# EAGLE design untitled (EAGLE 9.6.2)
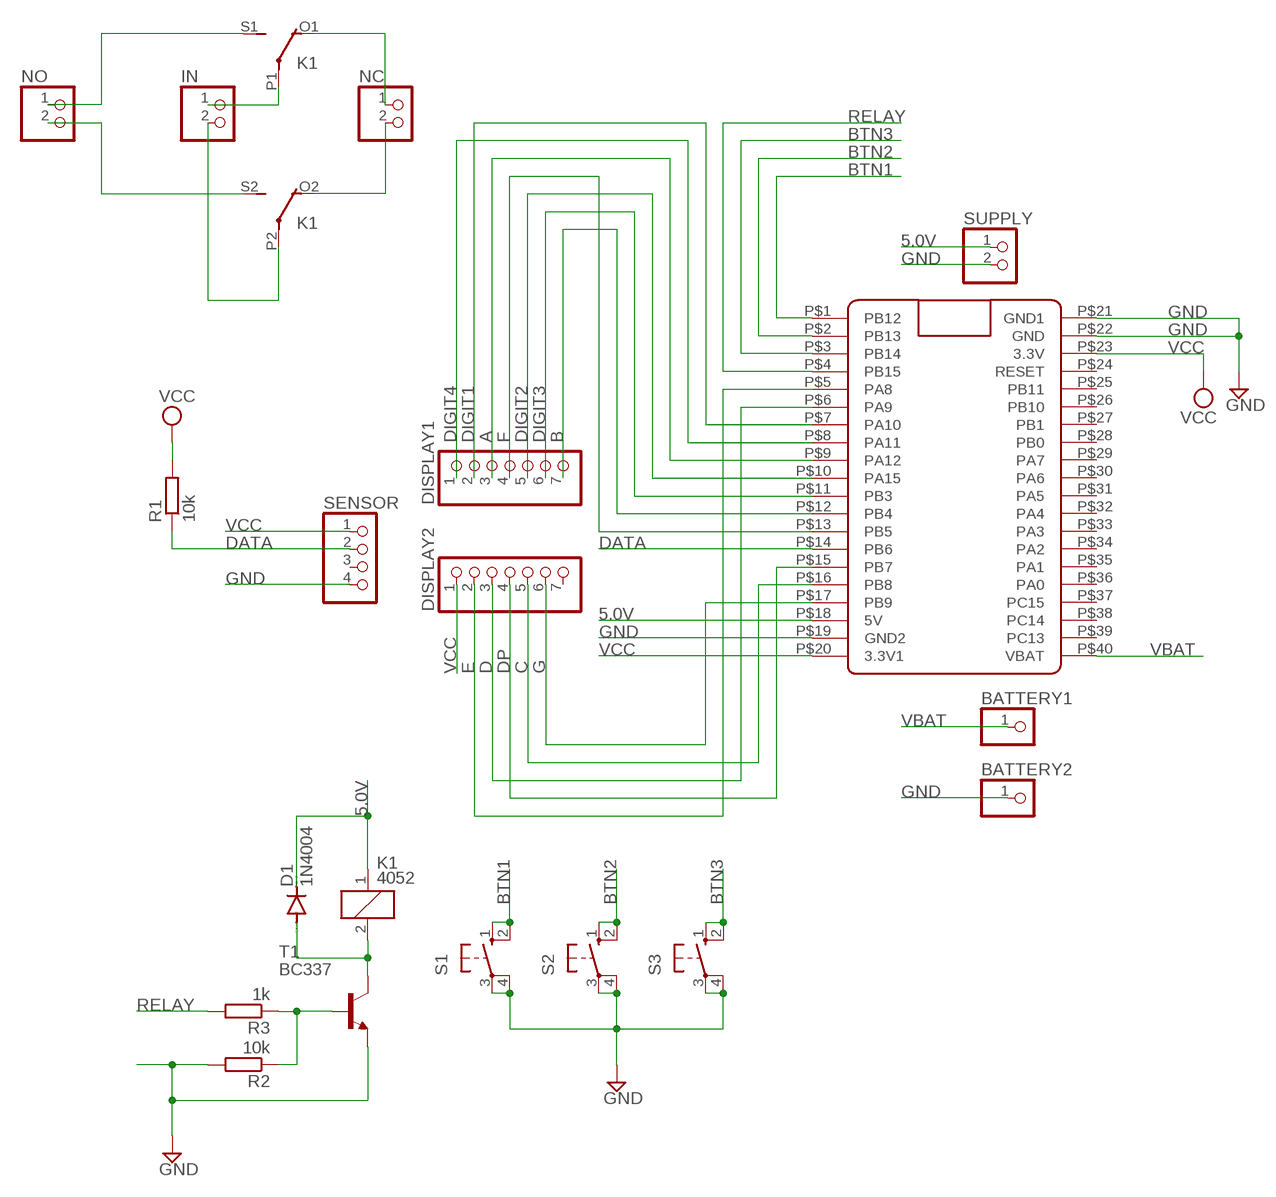
[diagram p0: schematic, sheet 1]

## Parts
BATTERY1  PINHD-1X1  [1X01]
BATTERY2  PINHD-1X1  [1X01]
D1  1N4004  [DO41-10]
DISPLAY1  PINHD-1X7  [1X07]
DISPLAY2  PINHD-1X7  [1X07]
IN  PINHD-1X2  [1X02]
K1  4052  [F4052]
NC  PINHD-1X2  [1X02]
NO  PINHD-1X2  [1X02]
R1  10k  R-EU_0207/10  [0207/10]
R2  10k  R-EU_0207/10  [0207/10]
R3  1k  R-EU_0207/10  [0207/10]
S1  10-XX  [B3F-10XX]
S2  10-XX  [B3F-10XX]
S3  10-XX  [B3F-10XX]
SENSOR  PINHD-1X4  [1X04]
SUPPLY  PINHD-1X2  [1X02]
T1  BC337  [TO92]
U$1  BLUE_PILL  [BLUE_PILL]

## Nets
5.0V: D1.C K1.1 SUPPLY.1 U$1.P$18(5V)
A: DISPLAY1.3 U$1.P$9(PA12)
B: DISPLAY1.7 U$1.P$12(PB4)
BTN1: S1.1(S) S1.2(S1) U$1.P$1(PB12)
BTN2: S2.1(S) S2.2(S1) U$1.P$2(PB13)
BTN3: S3.1(S) S3.2(S1) U$1.P$3(PB14)
C: DISPLAY2.5 U$1.P$16(PB8)
D: DISPLAY2.3 U$1.P$6(PA9)
DATA: R1.1 SENSOR.2 U$1.P$14(PB6)
DIGIT1: DISPLAY1.2 U$1.P$7(PA10)
DIGIT2: DISPLAY1.5 U$1.P$10(PA15)
DIGIT3: DISPLAY1.6 U$1.P$11(PB3)
DIGIT4: DISPLAY1.1 U$1.P$8(PA11)
DP: DISPLAY2.4 U$1.P$15(PB7)
E: DISPLAY2.2 U$1.P$5(PA8)
F: DISPLAY1.4 U$1.P$13(PB5)
G: DISPLAY2.6 U$1.P$17(PB9)
GND: BATTERY2.1 R2.2 S1.3(P) S1.4(P1) S2.3(P) S2.4(P1) S3.3(P) S3.4(P1) SENSOR.4 SUPPLY.2 T1.1(E) U$1.P$19(GND2) U$1.P$21(GND1) U$1.P$22(GND)
N$1: K1.O1(2:O) NC.1
N$2: K1.O2(3:O) NC.2
N$4: IN.2 K1.P2(3:P)
N$5: K1.S2(3:S) NO.2
N$6: D1.A K1.2 T1.3(C)
N$8: R2.1 R3.1 T1.2(B)
N$9: IN.1 K1.P1(2:P)
NO: K1.S1(2:S) NO.1
RELAY: R3.2 U$1.P$4(PB15)
VBAT: BATTERY1.1 U$1.P$40(VBAT)
VCC: DISPLAY2.1 R1.2 SENSOR.1 U$1.P$20(3.3V1) U$1.P$23(3.3V)
Unconnected: DISPLAY2.7 SENSOR.3 U$1.P$24(RESET) U$1.P$25(PB11) U$1.P$26(PB10) U$1.P$27(PB1) U$1.P$28(PB0) U$1.P$29(PA7) U$1.P$30(PA6) U$1.P$31(PA5) U$1.P$32(PA4) U$1.P$33(PA3) U$1.P$34(PA2) U$1.P$35(PA1) U$1.P$36(PA0) U$1.P$37(PC15) U$1.P$38(PC14) U$1.P$39(PC13)

## Library data of the parts
BATTERY1 BATTERY2 = pinhead:PINHD-1X1: PIN HEADER
D1 = diode:1N4004: DIODE general purpose rectifier, 1 A
DISPLAY1 DISPLAY2 = pinhead:PINHD-1X7: PIN HEADER
IN NC NO SUPPLY = pinhead:PINHD-1X2: PIN HEADER
K1 = relay:4052: RELAY 2 x switch, Finder; OC_FARNELL: unknown; OC_NEWARK: unknown
R1-R3 = rcl:R-EU_: RESISTOR, European symbol; SPICEPREFIX: R
S1-S3 = switch-omron:10-XX: OMRON SWITCH; MPN: B3F-1000; OC_FARNELL: 176432; OC_NEWARK: 36M3542
SENSOR = pinhead:PINHD-1X4: PIN HEADER
T1 = transistor:BC337: NPN TRANSISTOR
U$1 = BluePill:BLUE_PILL

## Net classes
0 default: clearance 0.205 mm

## Board
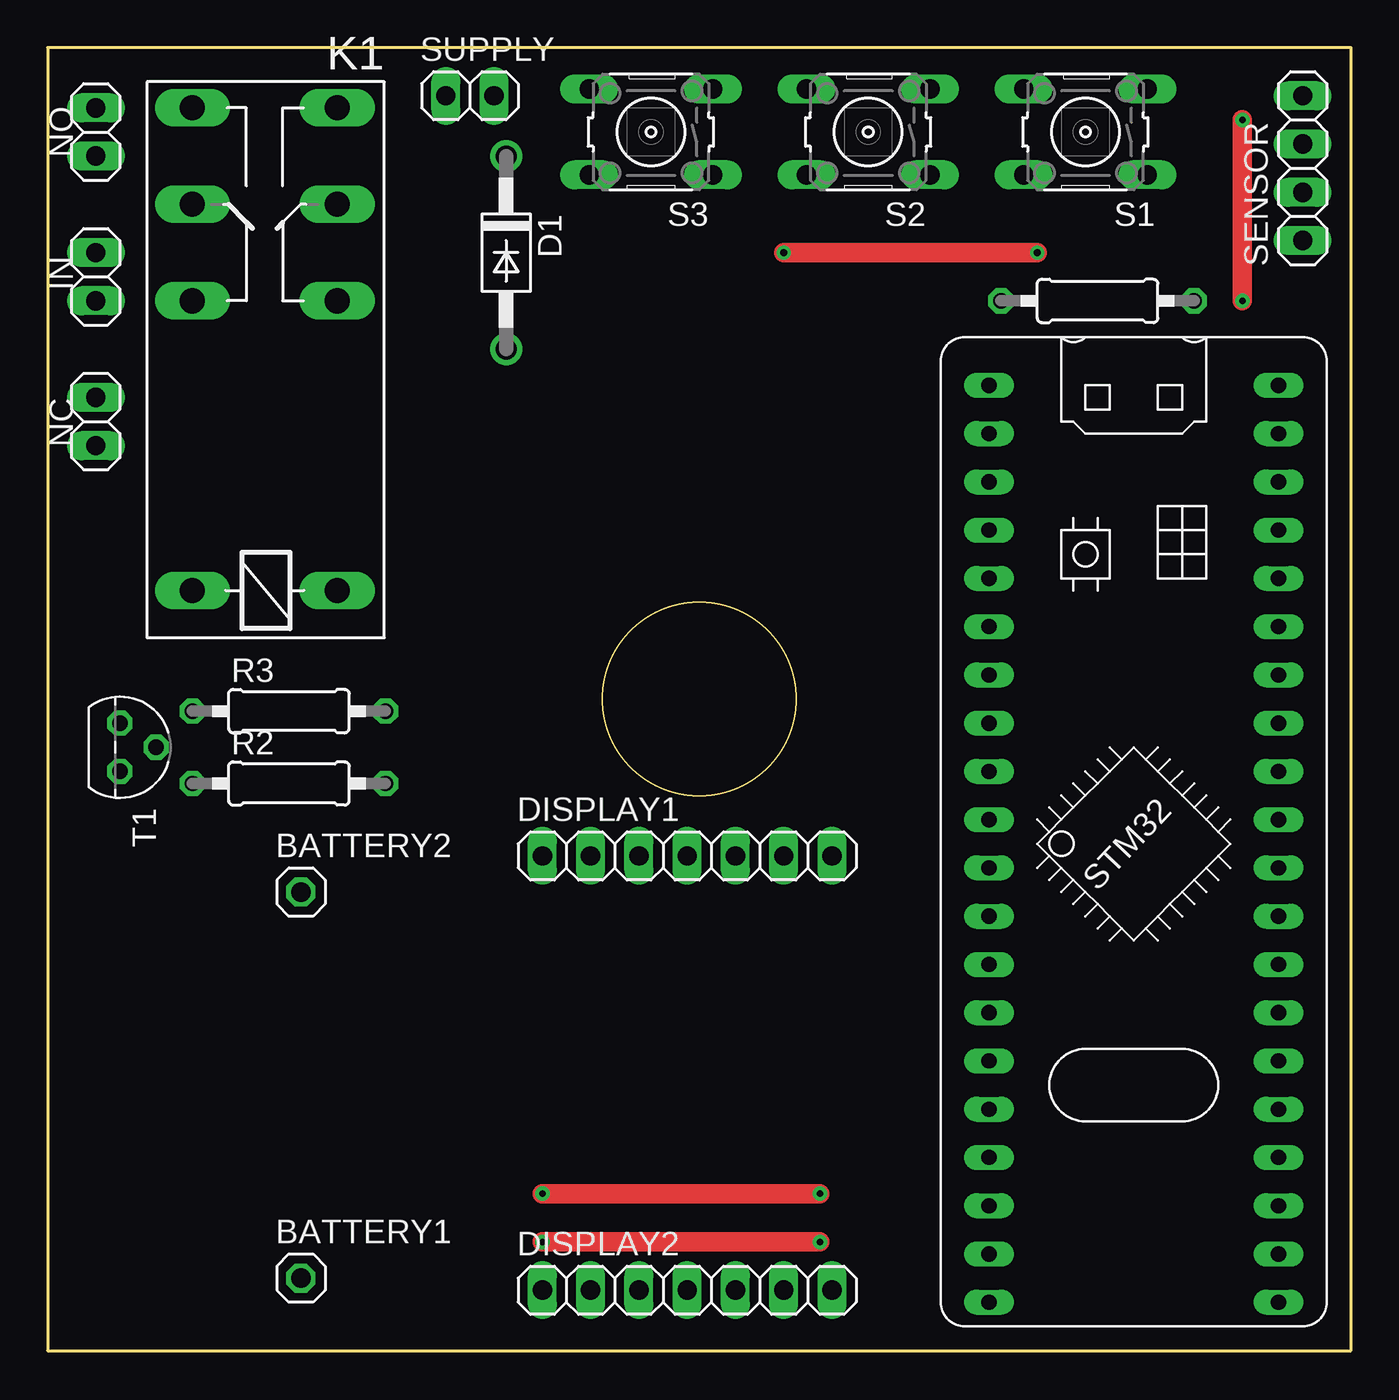
[diagram p1: board, top side]
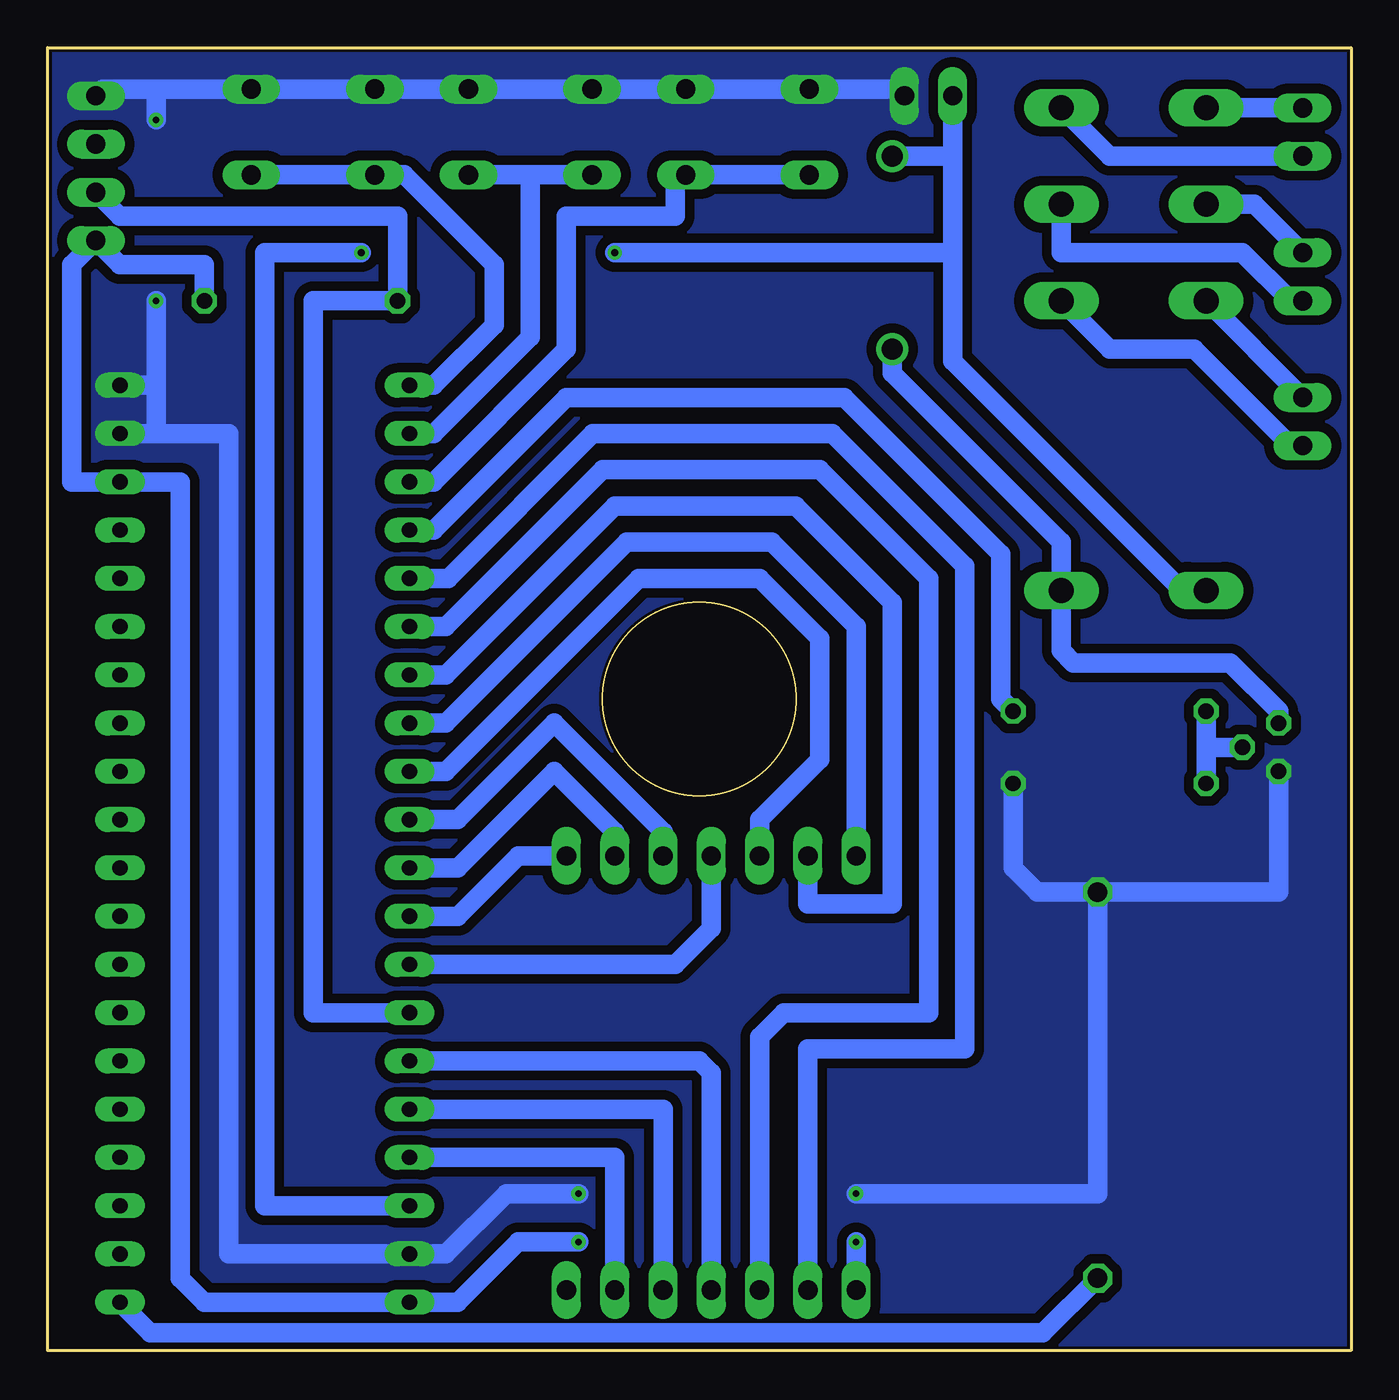
[diagram p2: board, bottom side, seen from below]

Size 68.58 x 68.58 mm. Coordinates in mm from the lower left corner, seen from the top.
Outline: 0,0 68.58,0 68.58,68.58 0,68.58 0,0
Outline: circle at 34.29,34.29 radius 5.08
Copper layers (1*16): Top 0.035mm / dielectric 1.5mm / Bottom 0.035mm
Design rules "default *": minimum track width 6mil, minimum drill 0.35mm, track to track 20mil, track to pad 8mil, pad to pad 6mil, via to via 6mil, smd to smd 6mil, copper to edge 6mil, drill to drill 6mil, minimum pad ring 10mil, minimum via ring 8mil, stop-mask expansion 4mil, vias tented up to drill 0mil, thermal gap 10mil

### Footprints (pad centres in the part's own frame; a part is rotated, then mirrored left to right if it is on the bottom)
1X01 = drill 1.016 octagon: 1 0,0
DO41-10 = drill 1.118: A 5.08,0; C -5.08,0
1X07 = drill 1.016 long: 1 -7.62,0; 2 -5.08,0; 3 -2.54,0; 4 0,0; 5 2.54,0; 6 5.08,0; 7 7.62,0
1X02 = drill 1.016 long: 1 -1.27,0; 2 1.27,0
F4052 = drill 1.321 long: 1 -3.81,3.81; 2 -3.81,-3.81; O1 11.43,-3.81; O2 11.43,3.81; P1 16.51,-3.81; P2 16.51,3.81; S1 21.59,-3.81; S2 21.59,3.81
0207/10 = drill 0.813 octagon: 1 -5.08,0; 2 5.08,0
B3F-10XX = drill 1.016 long: 1 -3.251,2.261; 2 3.251,2.261; 3 -3.251,-2.261; 4 3.251,-2.261
1X04 = drill 1.016 long: 1 -3.81,0; 2 -1.27,0; 3 1.27,0; 4 3.81,0
TO92 = drill 0.813 octagon: 1 1.27,0; 2 0,1.905; 3 -1.27,0
BLUE_PILL = drill 0.8 long: P$1 -7.62,15.24; P$2 -7.62,12.7; P$3 -7.62,10.16; P$4 -7.62,7.62; P$5 -7.62,5.08; P$6 -7.62,2.54; P$7 -7.62,0; P$8 -7.62,-2.54; P$9 -7.62,-5.08; P$10 -7.62,-7.62; P$11 -7.62,-10.16; P$12 -7.62,-12.7; P$13 -7.62,-15.24; P$14 -7.62,-17.78; P$15 -7.62,-20.32; P$16 -7.62,-22.86; P$17 -7.62,-25.4; P$18 -7.62,-27.94; P$19 -7.62,-30.48; P$20 -7.62,-33.02; P$21 7.62,15.24; P$22 7.62,12.7; P$23 7.62,10.16; P$24 7.62,7.62; P$25 7.62,5.08; P$26 7.62,2.54; P$27 7.62,0; P$28 7.62,-2.54; P$29 7.62,-5.08; P$30 7.62,-7.62; P$31 7.62,-10.16; P$32 7.62,-12.7; P$33 7.62,-15.24; P$34 7.62,-17.78; P$35 7.62,-20.32; P$36 7.62,-22.86; P$37 7.62,-25.4; P$38 7.62,-27.94; P$39 7.62,-30.48; P$40 7.62,-33.02

### Placement (x,y rotation side)
BATTERY1  13.34,3.81 0 top
BATTERY2  13.34,24.13 0 top
D1  24.13,57.78 270 top
DISPLAY1  33.66,26.04 0 top
DISPLAY2  33.66,3.17 0 top
IN  2.54,56.52 90 top
K1  11.43,43.81 90 top
NC  2.54,48.9 90 top
NO  2.54,64.14 90 top
R1  55.24,55.24 0 top
R2  12.7,29.84 0 top
R3  12.7,33.66 0 top
S1  54.61,64.14 180 top
S2  43.18,64.14 180 top
S3  31.75,64.14 180 top
SENSOR  66.04,62.23 90 top
SUPPLY  22.23,66.04 0 top
T1  3.81,31.75 270 top
U$1  57.15,35.56 0 top

### Tracks (layer width: path | path; a pad name or v marks a point on that pad's centre or on a via)
5.0V  (via drill 0.35)
  Top 1.016: v52.07,57.78 v38.73,57.78
  Bottom 1.016: U$1.P$18 57.15,7.62 57.15,57.78 v52.07,57.78 | 20.95,62.87 20.95,57.78 | 20.95,57.78 20.95,52.07 8.89,40.01 K1.1 | D1.C 20.95,62.87 | 20.95,57.78 v38.73,57.78 | SUPPLY.1 20.95,62.87
A
  Bottom 1.016: DISPLAY1.3 31.11,27.94 27.94,31.11 27.94,37.47 31.11,40.64 37.47,40.64 47.62,30.48 U$1.P$9
B
  Bottom 1.016: DISPLAY1.7 43.81,26.04 46.99,22.86 U$1.P$12
BTN1
  Bottom 1.016: S1.1 S1.2 49.81,61.87 45.09,57.15 45.09,53.98 48.26,50.8 U$1.P$1
BTN2
  Bottom 1.016: U$1.P$2 48.26,48.26 43.18,53.34 43.18,61.87 S2.1 S2.2
BTN3
  Bottom 1.016: S3.2 S3.1 35.56,61.32 35.56,59.69 41.27,59.69 41.27,52.7 48.26,45.72 U$1.P$3
C
  Bottom 1.016: DISPLAY2.5 36.2,12.7 U$1.P$16
D
  Bottom 1.016: DISPLAY2.3 31.11,16.51 29.84,17.78 22.23,17.78 22.23,40.64 27.94,46.35 39.37,46.35 47.62,38.1 U$1.P$6
DATA
  Bottom 1.016: U$1.P$14 54.61,17.78 54.61,55.24 R1.1 50.16,59.69 64.77,59.69 SENSOR.2
DIGIT1
  Bottom 1.016: DISPLAY1.2 28.57,23.5 24.13,23.5 24.13,39.37 29.21,44.45 38.73,44.45 47.62,35.56 U$1.P$7
DIGIT2
  Bottom 1.016: DISPLAY1.5 36.2,27.3 41.91,33.02 46.99,27.94 U$1.P$10
DIGIT3
  Bottom 1.016: DISPLAY1.6 38.73,27.3 41.91,30.48 46.99,25.4 U$1.P$11
DIGIT4
  Bottom 1.016: DISPLAY1.1 26.04,38.1 30.48,42.55 38.1,42.55 47.62,33.02 U$1.P$8
DP
  Bottom 1.016: DISPLAY2.4 33.66,14.61 34.29,15.24 U$1.P$15
E
  Bottom 1.016: DISPLAY2.2 28.57,15.88 20.32,15.88 20.32,41.27 27.3,48.26 39.89,48.26 47.51,40.64 U$1.P$5
F
  Bottom 1.016: DISPLAY1.4 33.66,22.23 35.56,20.32 U$1.P$13
G
  Bottom 1.016: DISPLAY2.6 38.73,10.16 U$1.P$17
GND  (via drill 0.35)
  Top 1.016: v62.87,55.24 v62.87,64.77 | v40.64,8.26 v26.04,8.26
  Bottom 1.016: U$1.P$22 62.87,48.26 | 62.87,48.26 59.05,48.26 59.05,5.08 U$1.P$19 47.62,5.08 44.45,8.26 v40.64,8.26 | v62.87,55.24 62.87,50.8 | U$1.P$21 62.87,50.8 | R2.2 17.78,25.4 16.51,24.13 BATTERY2.1 | BATTERY2.1 3.81,24.13 T1.1 | BATTERY2.1 13.34,8.26 v26.04,8.26 | SUPPLY.2 23.85,66.4 S3.4 S3.3 S2.4 S2.3 S1.4 S1.3 62.87,66.4 | SENSOR.4 65.68,66.4 62.87,66.4 | v62.87,64.77 62.87,66.4 | 62.87,50.8 62.87,48.26
  pour Bottom (no thermals): 0,68.58 0,0 68.58,0 68.58,68.58
N$1
  Bottom 1.016: NC.1 3.17,47.62 8.26,52.7 12.7,52.7 K1.O1
N$2
  Bottom 1.016: K1.O2 NC.2
N$4
  Bottom 1.016: IN.2 5.08,60.33 K1.P2
N$5
  Bottom 1.016: K1.S2 NO.2
N$6
  Bottom 1.016: D1.A 24.13,51.44 15.24,42.55 K1.2 15.24,36.83 14.61,36.2 6.35,36.2 3.81,33.66 T1.3
N$8
  Bottom 1.016: T1.2 7.62,31.75 | R3.1 7.62,31.75 | 7.62,31.75 R2.1
N$9
  Bottom 1.016: K1.P1 15.24,57.78 5.71,57.78 3.17,55.24 IN.1
NO
  Bottom 1.016: K1.S1 12.7,62.87 NO.1
RELAY
  Bottom 1.016: R3.2 18.41,34.29 18.41,41.91 26.67,50.16 41.27,50.16 48.26,43.18 U$1.P$4
VBAT
  Bottom 1.016: U$1.P$40 63.17,0.94 16.21,0.94 BATTERY1.1
VCC  (via drill 0.35)
  Top 1.016: v40.64,5.71 v26.04,5.71
  Bottom 1.016: v26.04,5.71 DISPLAY2.1 | R1.2 60.33,57.15 64.77,57.15 SENSOR.1 67.31,57.15 67.31,45.72 U$1.P$23 61.59,45.72 61.59,3.81 60.33,2.54 U$1.P$20 46.99,2.54 43.81,5.71 v40.64,5.71